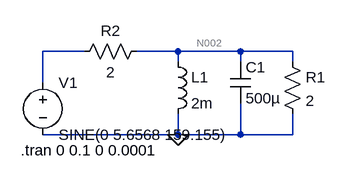
[diagram p0: schematic gate2015q30.asc]
gate2015q30.asc, the LTspice schematic file:
Version 4
SHEET 1 880 680
WIRE 32 96 -32 96
WIRE 176 96 112 96
WIRE 272 96 176 96
WIRE 352 96 272 96
WIRE 176 112 176 96
WIRE 272 112 272 96
WIRE 352 112 352 96
WIRE -32 144 -32 96
WIRE 176 224 176 192
WIRE 176 224 -32 224
WIRE 272 224 272 176
WIRE 272 224 176 224
WIRE 352 224 352 192
WIRE 352 224 272 224
FLAG 176 224 0
SYMBOL ind 160 96 R0
SYMATTR InstName L1
SYMATTR Value 2m
SYMBOL cap 256 112 R0
SYMATTR InstName C1
SYMATTR Value 500µ
SYMBOL res 336 96 R0
SYMATTR InstName R1
SYMATTR Value 2
SYMBOL res 128 80 R90
WINDOW 0 0 56 VBottom 2
WINDOW 3 32 56 VTop 2
SYMATTR InstName R2
SYMATTR Value 2
SYMBOL voltage -32 128 R0
WINDOW 123 0 0 Left 2
WINDOW 39 0 0 Left 2
SYMATTR InstName V1
SYMATTR Value SINE(0 5.6568 159.155)
TEXT -66 248 Left 2 !.tran 0 0.1 0 0.0001

The netlist it stands for:
* gate2015q30.asc
L1 N002 0 2m
C1 N002 0 500µ
R1 N002 0 2
R2 N002 N001 2
V1 N001 0 SINE(0 5.6568 159.155)
.tran 0 0.1 0 0.0001
.backanno
.end

* Results of the author's LTspice run, read from the files saved beside the schematic
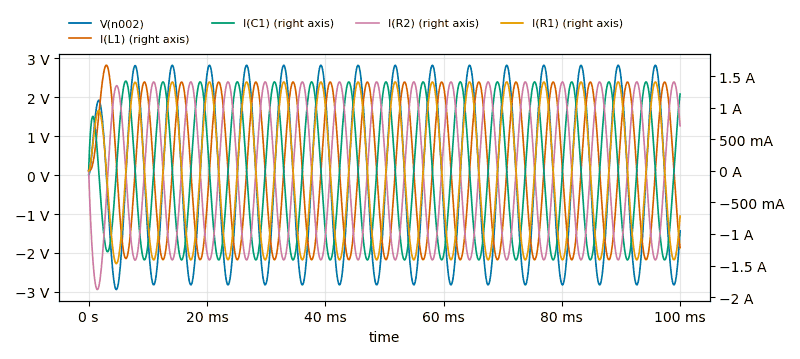
[diagram p1: Transient Analysis of gate2015q30.asc, plotted from the saved traces]
* Transient Analysis, 1 run:
*   V(n002): min -2.939 V, max 2.821 V, average -24.29 mV, rms 1.984 V, last -1.434 V
*   I(L1): min -1.409 A, max 1.676 A, average 35.36 mA, rms 996.8 mA, last -1.218 A
*   I(C1): min -1.411 A, max 1.424 A, average -7.186 mA, rms 988.3 mA, last 1.22 A
*   I(R2): min -1.88 A, max 1.411 A, average -16.03 mA, rms 1.012 A, last 715.2 mA
*   I(R1): min -1.469 A, max 1.41 A, average -12.15 mA, rms 991.9 mA, last -716.9 mA